# EAGLE design sensor_PCB (EAGLE 8.6.0)
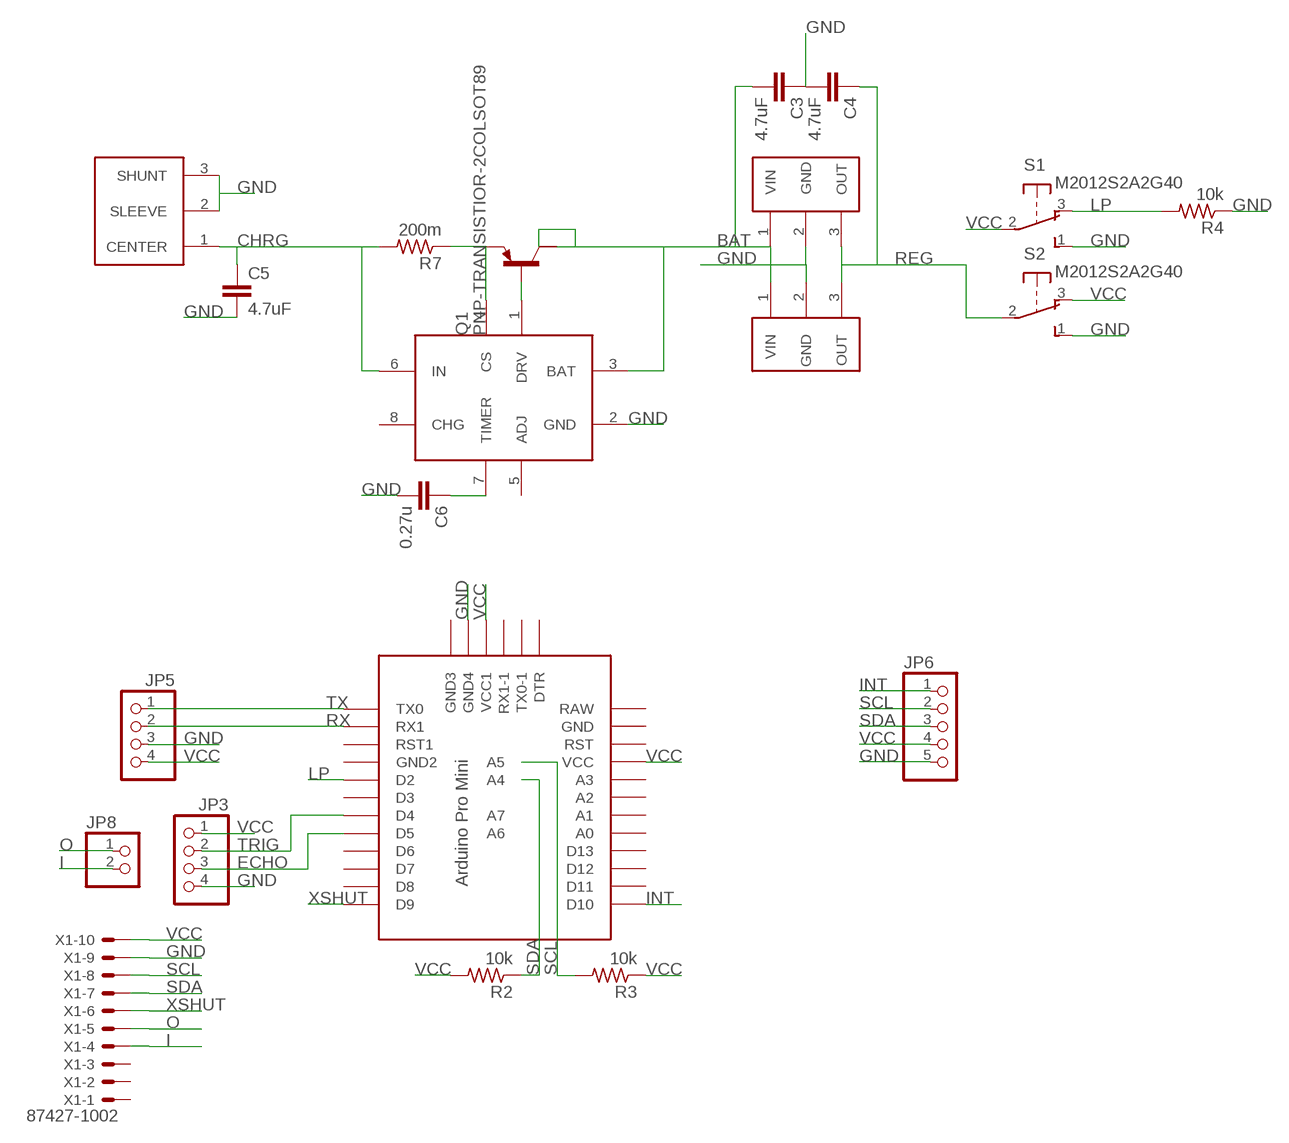
[diagram p0: schematic, sheet 1]

## Parts
C3  4.7uF  4.7UF0603  [0603]
C4  4.7uF  4.7UF0603  [0603]
C5  4.7uF  4.7UF0603  [0603]
C6  0.27u  0.33UF/330NF-0805-50V-10%  [0805]
JP3  PINHD-1X4  [1X04]
JP5  PINHD-1X4  [1X04]
JP6  PINHD-1X5  [1X05]
JP8  PINHD-1X2  [1X02]
Q1  PNP-TRANSISTIOR-2COLSOT89  [SOT89]
R2  10k  R-US_R0603  [R0603]
R3  10k  R-US_R0603  [R0603]
R4  10k  R-US_R0603  [R0603]
R7  200m  R-US_R0603  [R0603]
S1  M2012S2A2G40  [M2012S2A2G40]
S2  M2012S2A2G40  [M2012S2A2G40]
U$1  PRO-MINI-2  [PRO-MINI-2]
U$3  ADP2291  [8-MSOP]
V3  UCC283T-3  [TO220V]
V4  UCC283T-3  [TO220V]
V5  L712RAS  [L712RAS]
X1  87427-1002  [87427-1002]

## Nets
BAT: C3.2 Q1.2(C) Q1.2@1(C/) U$3.3(BAT) V3.1(VIN) V4.1(VIN)
CHRG: C5.1 R7.2 U$3.6(IN) V5.1(CENTER)
CS: Q1.3(E) R7.1 U$3.4(CS)
DRV: Q1.1(B) U$3.1(DRV)
ECHO: JP3.3 U$1.D5
GND: C3.1 C4.2 C5.2 C6.2 JP3.4 JP5.3 JP6.5 R4.1 S1.1(S) S2.1(S) U$1.GND3(GND4) U$3.2(GND) V3.2(GND) V4.2(GND) V5.2(SLEEVE) V5.3(SHUNT) X1.9
I: JP8.2 X1.4
INT: JP6.1 U$1.D10
LP: R4.2 S1.3(O) U$1.D2
O: JP8.1 X1.5
REG: C4.1 S2.2(P) V3.3(OUT) V4.3(OUT)
RX: JP5.2 U$1.RX1
SCL: JP6.2 R3.2 U$1.A5 X1.8
SDA: JP6.3 R2.1 U$1.A4 X1.7
TIMER: C6.1 U$3.7(TIMER)
TRIG: JP3.2 U$1.D4
TX: JP5.1 U$1.TX0
VCC: JP3.1 JP5.4 JP6.4 R2.2 R3.1 S1.2(P) S2.3(O) U$1.VCC U$1.VCC1 X1.10
XSHUT: U$1.D9 X1.6
Unconnected: U$1.A0 U$1.A1 U$1.A2 U$1.A3 U$1.A6 U$1.A7 U$1.D3 U$1.D6 U$1.D7 U$1.D8 U$1.D11 U$1.D12 U$1.D13 U$1.DTR U$1.GND U$1.GND1(GND2) U$1.GND2(GND3) U$1.RAW U$1.RST U$1.RST1 U$1.RX1-1 U$1.TX0-1 U$3.5(ADJ) U$3.8(CHG) X1.1 X1.2 X1.3

## Library data of the parts
C3-C5 = SparkFun-Capacitors:4.7UF: 4.7µF ceramic capacitors A capacitor is a passive two-terminal electrical component used to store electrical energy temporarily in an electric field.; PROD_ID: CAP-08280
C6 = SparkFun-Capacitors:0.33UF/330NF: 0.33µF/330nF ceramic capacitors A capacitor is a passive two-terminal electrical component used to store electrical energy temporarily in an electric field.; PROD_ID: CAP-08469; VALUE: 0.33µF
JP3 JP5 = pinhead:PINHD-1X4: PIN HEADER
JP6 = pinhead:PINHD-1X5: PIN HEADER
JP8 = pinhead:PINHD-1X2: PIN HEADER
Q1 = semicon-smd-ipc:PNP-TRANSISTIOR-2COL: PNP TRANSISTOR 2 colletor pins
R2-R4 R7 = resistor:R-US_: RESISTOR, American symbol
S1 S2 = SeanSylwester:M2012S2A2G40: MARQUARDT SWITCH 9077.0100 Distributor: Buerklin <https://www.buerklin.com/default.asp?event=ShowArtikel%2812G2820%29&l=d&jump=ArtNr_12G2820>
U$1 = Arduino-clone:PRO-MINI-2: Arduino Pro Mini Layout 2 Sparkfun.com
U$3 = SeanSylwester:ADP2291
V3 V4 = SeanSylwester:UCC283T-3
V5 = SeanSylwester:L712RAS
X1 = SeanSylwester:87427-1002: Mini FIT connector 10 pol Source: http://www.molex.com; MF: MOLEX; OC_FARNELL: unknown; OC_NEWARK: unknown

## Board
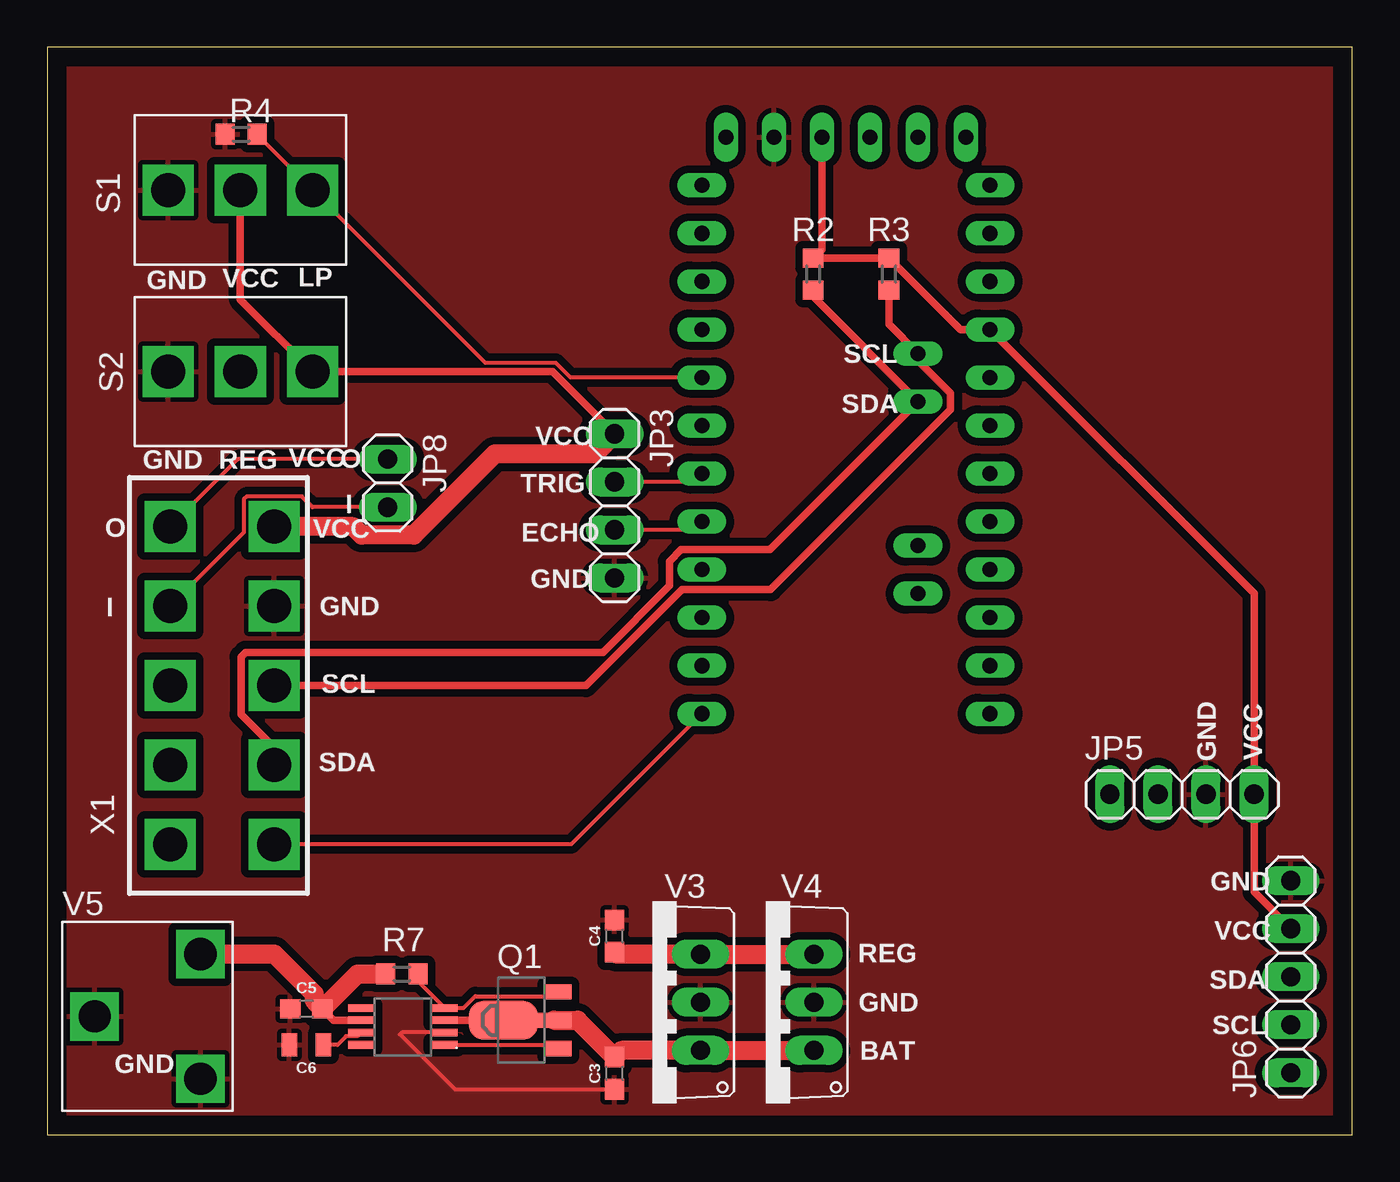
[diagram p1: board, top side]
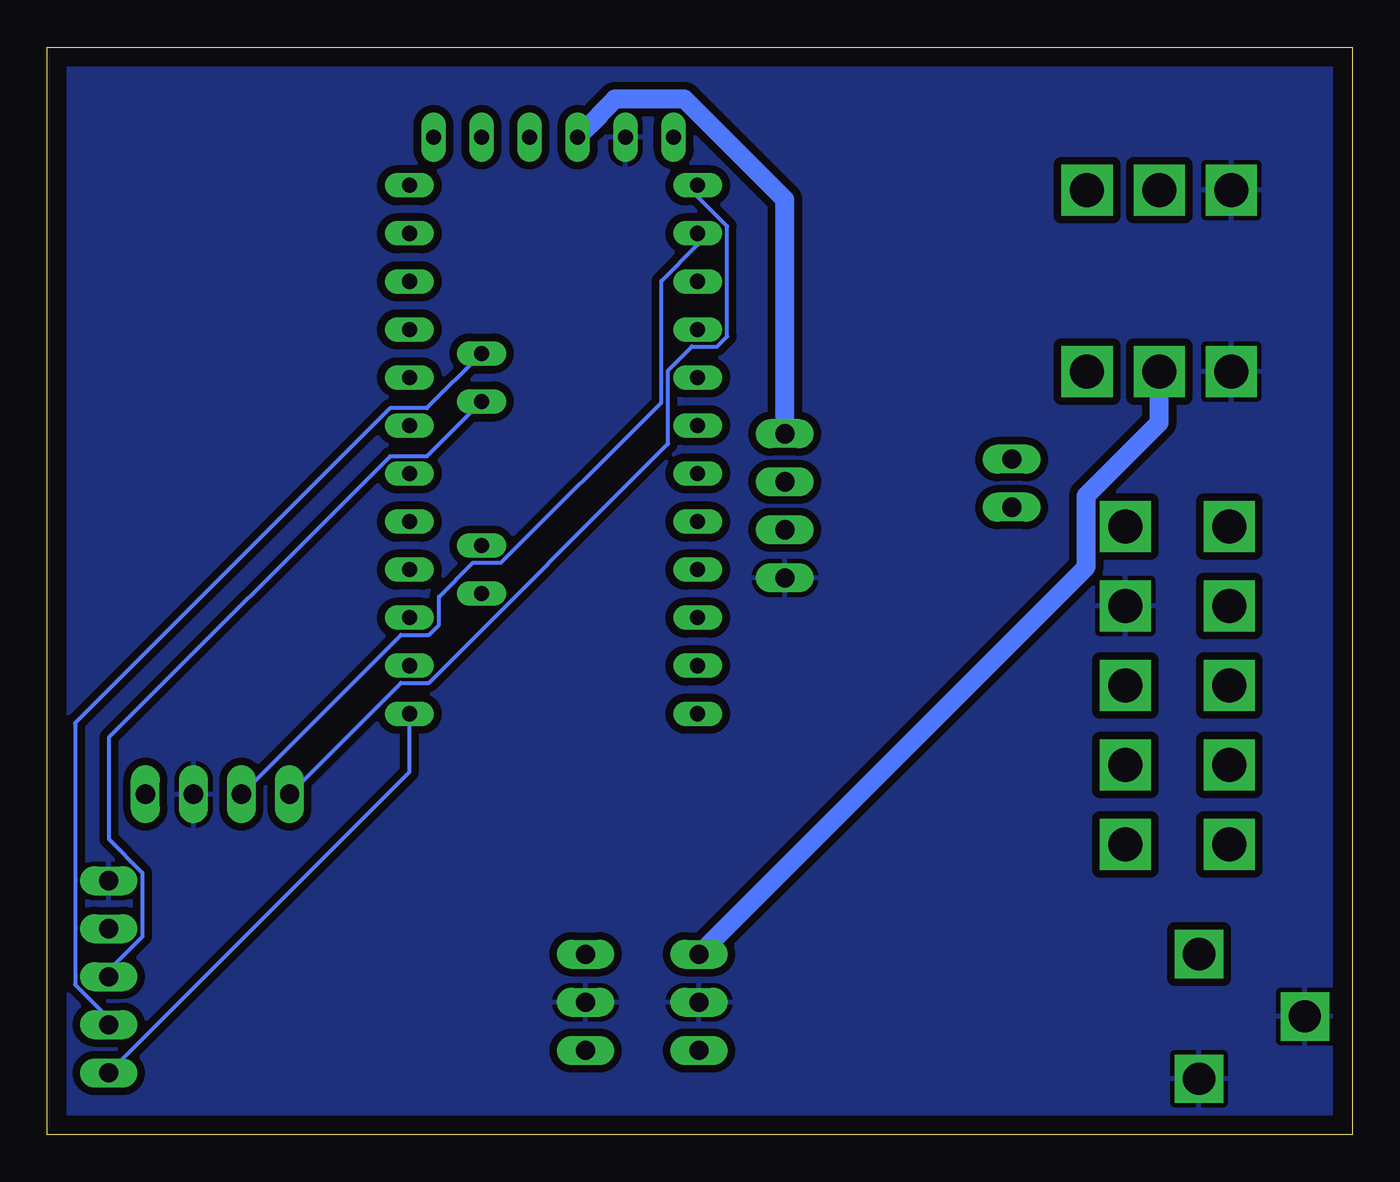
[diagram p2: board, bottom side, seen from below]

Size 69 x 57.5 mm. Coordinates in mm from the lower left corner, seen from the top.
Outline: 0,0 69,0 69,57.5 0,57.5 0,0
Copper layers (1*16): Top 0.035mm / dielectric 1.5mm / Bottom 0.035mm
Design rules "default *": minimum track width 8mil, minimum drill 0.35mm, track to track 6mil, track to pad 6mil, pad to pad 6mil, via to via 6mil, smd to smd 6mil, copper to edge 40mil, drill to drill 8mil, minimum pad ring 10mil, minimum via ring 8mil, stop-mask expansion 4mil, vias tented up to drill 0mil, thermal gap 10mil

### Footprints (pad centres in the part's own frame; a part is rotated, then mirrored left to right if it is on the bottom)
0603 = smd 1.1 x 1: 1 -0.85,0; 2 0.85,0
0805 = smd 0.8 x 1.2: 1 -0.9,0; 2 0.9,0
1X04 = drill 1.016 long: 1 -3.81,0; 2 -1.27,0; 3 1.27,0; 4 3.81,0
1X05 = drill 1.016 long: 1 -5.08,0; 2 -2.54,0; 3 0,0; 4 2.54,0; 5 5.08,0
1X02 = drill 1.016 long: 1 -1.27,0; 2 1.27,0
SOT89 = smd 0.8 x 1.4: 1 -1.499,-1.981; 3 1.499,-1.981 | smd 0.8 x 1.9: 2 0,-1.727 | smd 2.032 x 3.65: 2@1 0,0.94
R0603 = smd 1 x 1.1: 1 -0.85,0; 2 0.85,0
M2012S2A2G40 = drill 1.8 square: 1 0,0; 2 3.81,0; 3 7.62,0
PRO-MINI-2 = drill 0.8 long: A0 6.35,2.54; A1 6.35,0; A2 6.35,-2.54; A3 6.35,-5.08; A4 2.54,1.27; A5 2.54,3.81; A6 2.54,-8.89; A7 2.54,-6.35; D2 -8.89,2.54; D3 -8.89,0; D4 -8.89,-2.54; D5 -8.89,-5.08; D6 -8.89,-7.62; D7 -8.89,-10.16; D8 -8.89,-12.7; D9 -8.89,-15.24; D10 6.35,-15.24; D11 6.35,-12.7; D12 6.35,-10.16; D13 6.35,-7.62; DTR 5.08,15.24; GND 6.35,10.16; GND1 -8.89,5.08; GND2 -7.62,15.24; GND3 -5.08,15.24; RAW 6.35,12.7; RST 6.35,7.62; RST1 -8.89,7.62; RX1 -8.89,10.16; RX1-1 0,15.24; TX0 -8.89,12.7; TX0-1 2.54,15.24; VCC 6.35,5.08; VCC1 -2.54,15.24
8-MSOP = smd 1.4 x 0.4: 1 0.8,2.25; 2 0.8,1.6; 3 0.8,0.95; 4 0.8,0.3; 5 5.2,0.3; 6 5.2,0.95; 7 5.2,1.6; 8 5.2,2.25
TO220V = drill 1.016 long: 1 -2.54,-2.54; 2 0,-2.54; 3 2.54,-2.54
L712RAS = drill 1.7 square: 1 5.6,3.3; 2 0,0; 3 5.6,-3.3
87427-1002 = drill 1.8 square: 1 8.4,0; 2 4.2,0; 3 0,0; 4 -4.2,0; 5 -8.4,0; 6 8.4,5.5; 7 4.2,5.5; 8 0,5.5; 9 -4.2,5.5; 10 -8.4,5.5

### Placement (x,y rotation side)
C3  30,3.25 90 top
C4  30,10.5 90 top
C5  13.7,6.65 180 top
C6  13.7,4.75 180 top
JP3  30,33.25 270 top
JP5  60,18 0 top
JP6  65.75,8.35 90 top
JP8  18,34.45 270 top
Q1  25.05,6.05 90 top
R2  40.5,45.5 90 top
R3  44.5,45.5 270 top
R4  10.25,52.9 0 top
R7  18.75,8.5 180 top
S1  6.4,49.95 0 top
S2  6.4,40.35 0 top
U$1  43.5,37.5 0 top
U$3  21.8,7 180 top
V3  32,7 90 top
V4  38,7 90 top
V5  2.5,6.25 0 top
X1  6.5,23.75 270 top

### Tracks (layer width: path | path; a pad name or v marks a point on that pad's centre or on a via)
BAT
  Top 0.406: U$3.3 Q1.2@1 Q1.2
  Top 1.016: V4.1 V3.1 30.36,4.46 C3.2 28.05,6.05 Q1.2
CHRG
  Top 0.406: U$3.6 15.15,6.05 C5.1
  Top 1.016: R7.2 16.4,8.5 C5.1 14.11,7.09 14.11,7.45 12.01,9.55 V5.1
CS
  Top 0.203: Q1.3 26.8,7.32 22.63,7.32 22.01,6.7 U$3.4 19.6,8.1 R7.1
DRV
  Top 0.203: U$3.1 26.83,4.75 Q1.1
ECHO
  Top 0.203: U$1.D5 34.17,31.98 JP3.3
GND
  Top 0.203: U$3.2 18.75,5.4 18.65,5.3 21.55,2.4 C3.1
  pour Bottom (isolate 0.406): 69,0 69,57.5 0,57.5 0,0
  pour Top (isolate 0.406): 0,0 0,57.5 69,57.5 69,0
I
  Top 0.203: X1.4 10.4,31.85 10.4,33.6 10.54,33.75 13.46,33.75 14.03,33.18 JP8.2
INT
  Bottom 0.203: JP6.1 49.85,19.17 U$1.D10
LP
  Top 0.203: U$1.D2 27.67,40.04 26.9,40.81 23.16,40.81 S1.3 11.1,52.87 R4.2
O
  Top 0.203: JP8.1 10.07,35.72 X1.5
REG
  Top 1.016: V4.3 V3.3 30.11,9.54 C4.1
  Bottom 1.016: V3.3 14.06,30.02 14.06,33.8 10.21,37.65 S2.2
RX
  Bottom 0.203: JP5.2 50.3,26.43 48.82,26.43 48.29,26.96 48.29,28.44 46.49,30.24 45.01,30.24 36.53,38.72 36.53,45.14 34.61,47.06 U$1.RX1
SCL
  Top 0.406: R3.2 44.5,42.85 U$1.A5 46.04,40.92 47.75,39.21 47.75,38.33 38.24,28.82 33.55,28.82 28.48,23.75 X1.8
  Bottom 0.203: U$1.A5 48.94,38.41 50.88,38.41 67.53,21.76 67.53,7.93 65.75,6.15 JP6.2
SDA
  Top 0.406: R2.1 40.5,44.31 U$1.A4 38.21,30.94 33.52,30.94 32.9,30.32 32.9,29.03 29.37,25.51 10.48,25.51 10.24,25.27 10.24,22.23 12,20.48 X1.7
  Bottom 0.203: U$1.A4 48.94,35.87 50.88,35.87 65.75,21 65.75,15.63 63.97,13.85 63.97,10.47 65.75,8.69 JP6.3
TIMER
  Top 0.203: U$3.7 16.4,5.2 15.79,5.2 15.34,4.75 C6.1
TRIG
  Top 0.203: U$1.D4 34.17,34.52 JP3.2
TX
  Bottom 0.203: JP5.1 50.3,23.89 48.82,23.89 36.17,36.54 36.17,40.42 34.92,41.67 33.58,41.67 33.05,42.2 33.05,48.04 34.61,49.6 U$1.TX0
VCC
  Top 0.406: U$1.VCC1 40.96,46.81 R2.2 R3.1 48.27,42.58 U$1.VCC 63.81,28.62 JP5.4 63.81,12.83 JP6.4 | JP3.1 26.71,40.35 S2.3 10.21,44.16 S1.2
  Top 1.016: JP3.1 28.93,35.99 23.66,35.99 19.37,31.71 16.63,31.71 16.18,32.15 X1.10
  Bottom 1.016: U$1.VCC1 39.78,53.91 39.78,53.96 38.98,54.76 35.31,54.76 30,49.45 JP3.1
XSHUT
  Top 0.203: U$1.D9 27.7,15.35 X1.6

### Text on the board
tPlace: GND | VCC | LP | SCL | SDA | VCC | GND | REG | VCC | O | TRIG | I | O | VCC | ECHO | GND | I | GND | SCL | GND | VCC | SDA | GND | VCC | REG | SDA | GND | SCL | BAT | GND